# Altium schematic sheet Sheet1.SchDoc
size A3
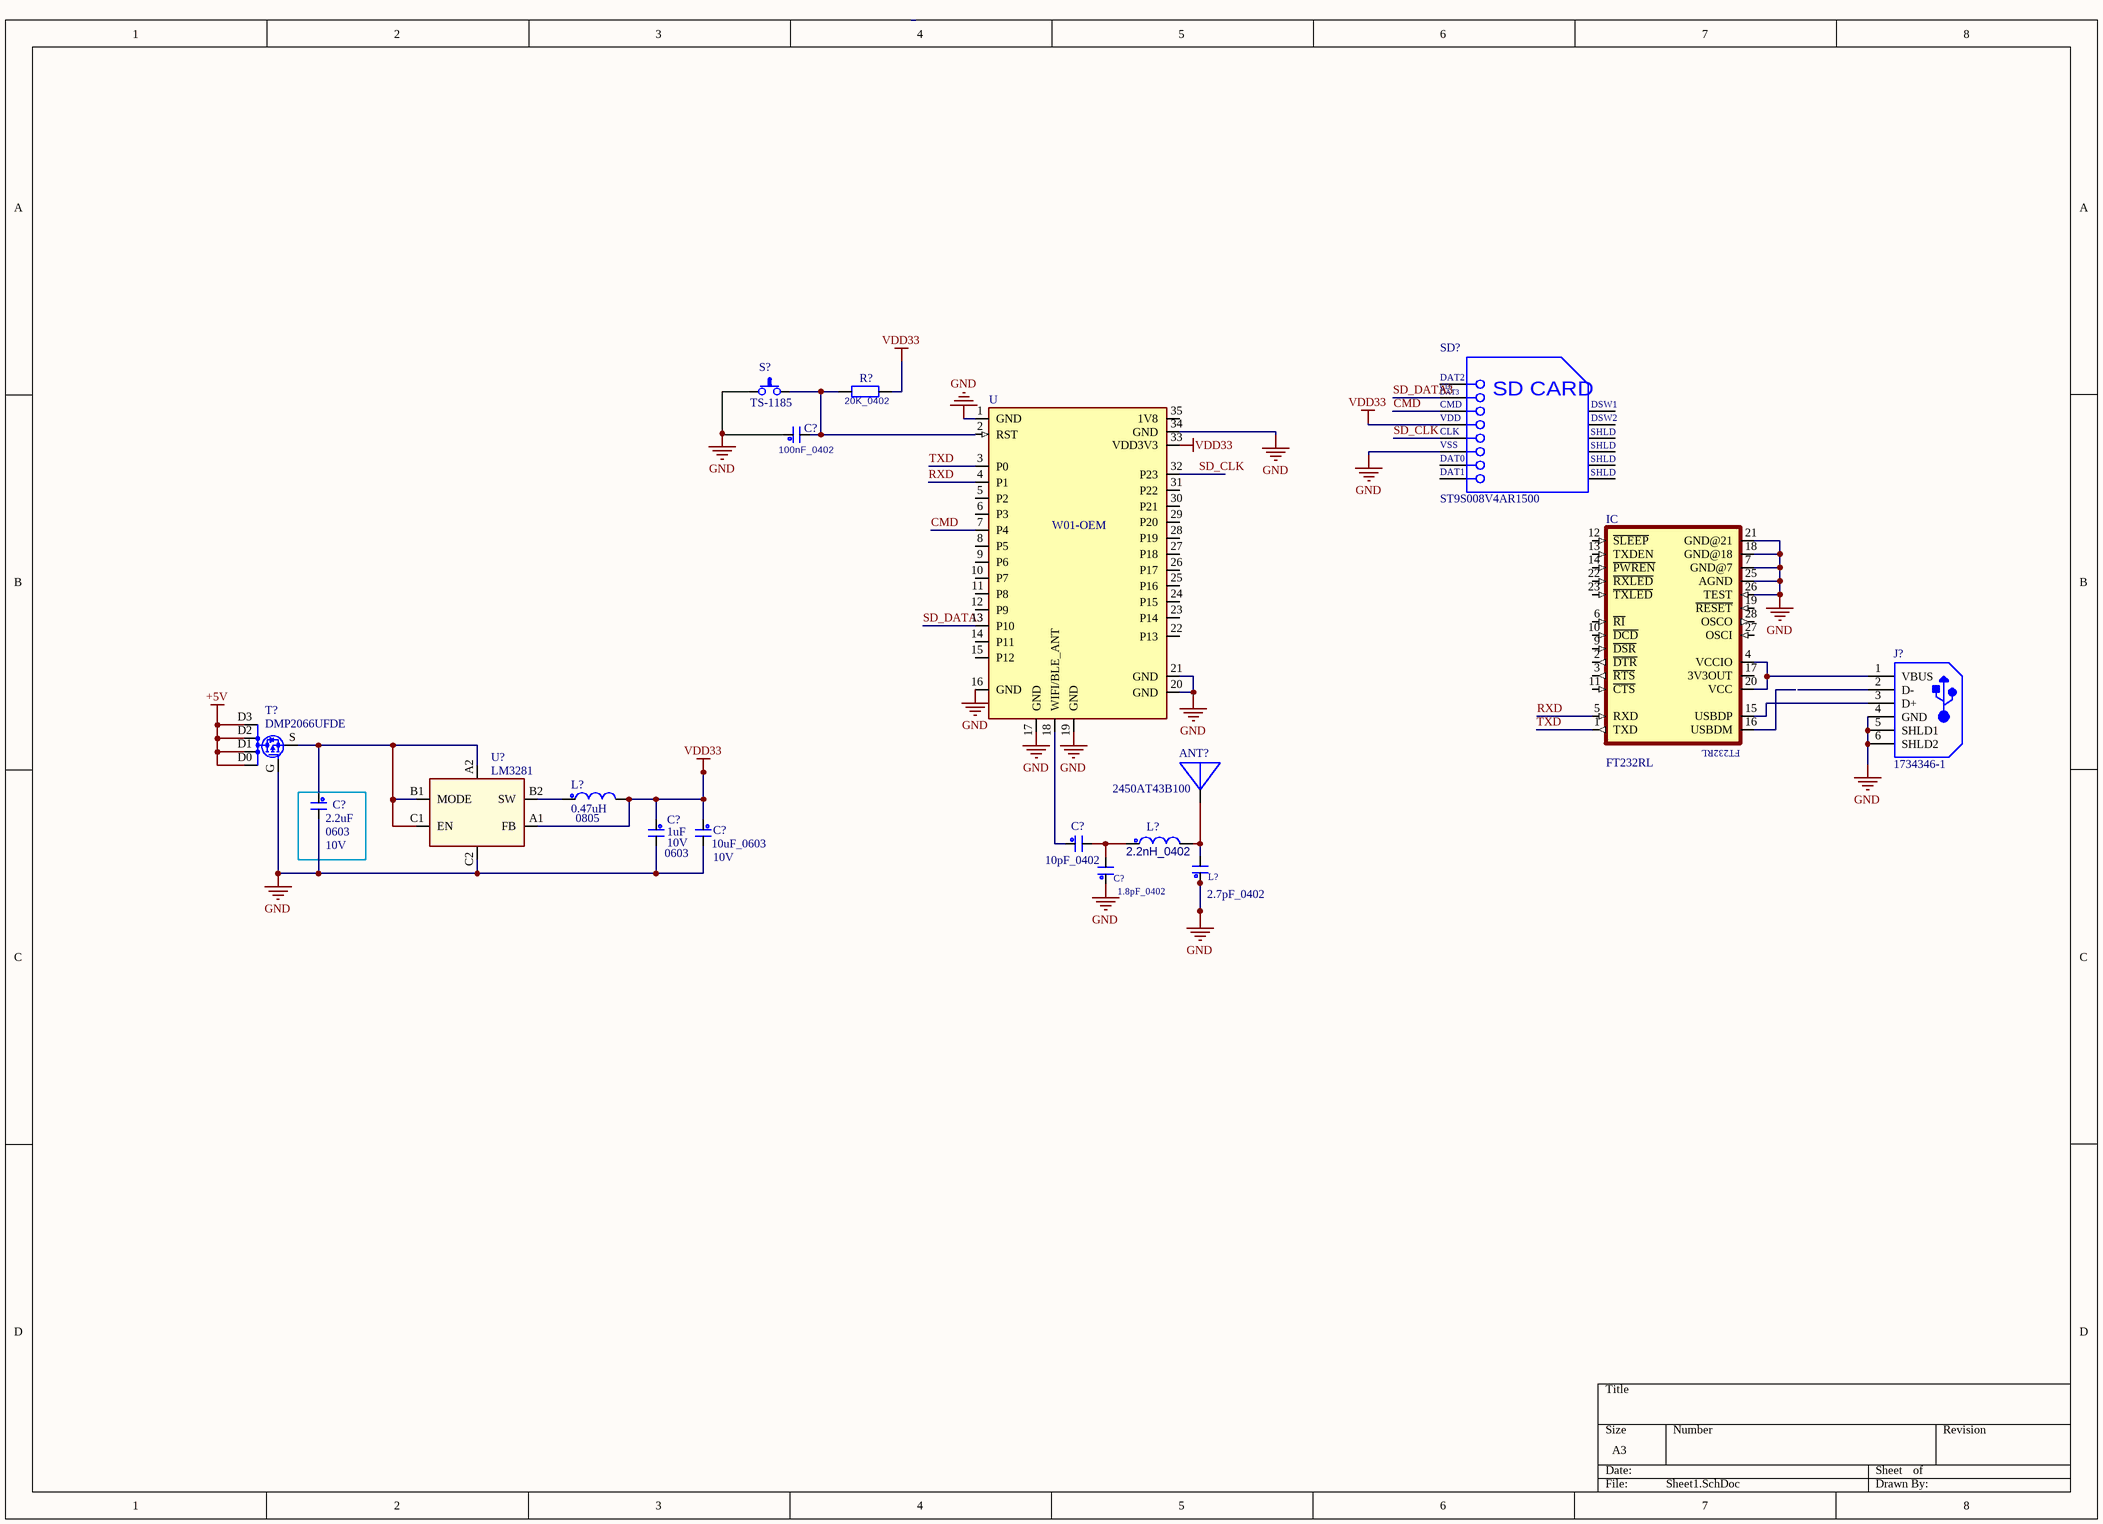
[diagram p0: Sheet1.SchDoc]

## Parts
(Parts that share a designator on the sheet are numbered #1, #2 ... from top to bottom, then left to right.)
ANT?  value 2450AT43B100  [ANT-2450AT43B100]  (hidden comment: ANT2450AT43B100)
C?#1  100nF_0402  [0402C]
C?#2  value 2.2uF  Voltage Rating: 10V  FOOTPRINT: 0603  [0603C]  (hidden comment: 2.2UF_0603)
C?#3  value 1uF  Voltage Rating: 10V  footprint: 0603  [0603C]  (hidden comment: 1uF_0603)
C?#4  10uF_0603  Voltage Rating: 10V  [0603C]
C?#5  10pF_0402  [0402CS]
C?#6  1.8pF_0402  [0402CS]
IC  FT232RL  [SSOP28-LD]
J?  1734346-1  [TECO-1734346-1_V]
L?#1  value 0.47uH  PCB DECAL: 0805  [0805L]  (hidden comment: 0.47uH_0805)
L?#2  2.2nH_0402  [0402CS]
L?#3  2.7pF_0402  [0402CS]
R?  20K_0402  [0402R]
S?  TS-1185  [SW-TS-1185]
SD?  ST9S008V4AR1500  [JAE-ST9S008V4AR1500_V]
T?  DMP2066UFDE  [U-DFN2020-6]
U  W01-OEM  [PYCOM_W01-OEM]
U?  value LM3281  [DSBGA6(YFQ)]  (hidden comment: IC-LM3281)

## Nets
+5V: T?.D0 T?.D1 T?.D2 T?.D3
GND: C?#1.1 C?#2.2 C?#3.2 C?#4.2 C?#6.1 IC.7(GND@7) IC.18(GND@18) IC.21(GND@21) IC.25(AGND) IC.26(TEST) J?.4(GND) J?.5(SHLD1) J?.6(SHLD2) L?#3.1 S?.1 SD?.6(VSS) T?.G U.1(GND) U.16(GND) U.17(GND) U.19(GND) U.20(GND) U.21(GND) U.34(GND) U?.C2(Gnd)
VDD33: C?#3.1 C?#4.1 L?#1.2 R?.2 SD?.4(VDD) U.33(VDD3V3) U?.A1(FB)
CMD: SD?.3(CMD) U.7(P4)
RXD: IC.5(RXD) U.4(P1)
SD_CLK: SD?.5(CLK) U.32(P23)
SD_DATA3: SD?.2(CD/DAT3) U.13(P10)
TXD: IC.1(TXD) U.3(P0)
NetANT?_1: ANT?.1 L?#2.2 L?#3.2
NetC?#1_2: C?#1.2 R?.1 S?.2 U.2(RST)
NetC?#2_1: C?#2.1 T?.S U?.A2 U?.B1(MODE) U?.C1(EN)
NetC?#5_1: C?#5.1 U.18(WIFI/BLE_ANT)
NetC?#5_2: C?#5.2 C?#6.2 L?#2.1
NetIC_4: IC.4(VCCIO) IC.20(VCC) J?.1(VBUS)
NetL?#1_1: L?#1.1 U?.B2(SW)

Not connected (* = marked no-connect by the designer): IC 2(~{DTR}) 3(~{RTS}) 6(~{RI}) 9(~{DSR}) 10(~{DCD}) 11(~{CTS}) 12(~{SLEEP}) 13(TXDEN) 14(~{PWREN}) 15(USBDP) 16(USBDM) 17(3V3OUT) 19(~{RESET}) 22(~{RXLED}) 23(~{TXLED}) 27(OSCI) 28(OSCO); J? 2(D-) 3(D+); SD? 1(DAT2) 7(DAT0) 8(DAT1) 9(DSW1) 10(DSW2) 11(SHLD) 12(SHLD) 13(SHLD) 14(SHLD); U 5(P2) 6(P3) 8(P5) 9(P6) 10(P7) 11(P8) 12(P9) 14(P11) 15(P12) 22(P13) 23(P14) 24(P15) 25(P16) 26(P17) 27(P18) 28(P19) 29(P20) 30(P21) 31(P22) 35(1V8)

## Notes on the sheet
- (in symbol CMP-1754-00001-2) CD/; DAT3; SD CARD

## Library data of the parts
ANT? = ANT2450AT43B100: Part Number: EAT-6548454-00
C?#1 = CC0402/100NF/K%16V: Part Number: ECH-012K104-39; Tolerance: +/-10 %; Voltage Rating: 16V; Value: 100nF_0402
C?#2 C?#4 = CC0603/10UF/10V/K%: Part Number: ECH-181K106-04; Tolerance: +/-10 %
  C?#4: Value: 10uF_0603
C?#3 = CC0603/1UF/K%/10V: Part Number: ECH-112K105-21; Tolerance: +/-10 %
C?#5 = CC0402/10PF/D%_S: Part Number: ECH-004D100-21; Tolerance: +/-0.5pF; Voltage Rating: 50V; PCB DECAL: 0402; Value: 10pF_0402
C?#6 L?#3 = CC0402/0,5pF/+/-0.1pF_S: Part Number: ECH-004B059-37; PCB DECAL: 0402; Vender: Murata  GJM1555C1HR50BB01J D C0G/NP0; Tolerance: +/-0.1pF
  C?#6: Value: 1.8pF_0402
  L?#3: Value: 2.7pF_0402
IC = FT232RL: USB ë¸Œë¦¬ì§€, USB-UART USB 2.0 UART ì¸í„°íŽ˜ì´ìŠ¤ 28-SSOP; MF: FTDI, Future; Package: SSOP-28 FTDI, Future; Price: None; Availability: Unavailable; MP: FT232RL; SnapEDA_Link: https://www.snapeda.com/parts/FT232RL/FTDI%2C%20Future%20Technology%20Devices%20International%20Ltd/view-part/1077088/?ref=snap; Value: *
J? = CMP-2000-07498-1: USB-B Receptacle Connector, Height 10.87 mm, 0 to 50 degC, RoHS, Tray; Manufacturer: TE Connectivity; Insulation Resistance: 1GR; Number of Contacts: 4; Number of Ports: 1; Plating: Nickel; Case\/Package: SMD/SMT; Insulation Material: Thermoplastic; Gender: Receptacle; Depth: 16mm; Contact Material: Bronze; Length: 16.5mm; ELV: Compliant; Packaging: Tray; RoHSCompliant: true; Number of Terminals: 4; Manufacturer URL: http://www.te.com/; Datasheet Version: Rev. C, 06/2011; Package Reference: 1734346-1; Flammability Rating: UL94V-0; Package Description: 4-Pin Pin Surface Mount Device, Body 12.04 x 16 mm, Height 10.87 mm; Mount: Horizontal; Mounting Technology: SurfaceMount; REACH SVHC: Unknown; Material: Bronze; Housing Colour: Black; Contact Plating: Gold; Package Quantity: 100; Orientation: RightAngle; Termination: SMD/SMT; Housing Material: Nylon; Number of Positions: 4; Datasheet URL: http://www.te.com/commerce/DocumentDelivery/DDEController?Action=srchrtrv&DocNm=1734346&DocType=Customer+Drawing&DocLang=English; Connector Type: Receptacle
L?#1 = IND0805/0.47uH/20%: Part Number: ELC-4Z0M474-11; Tolerance: +/-20%
L?#2 = IND0402/6.8nH/+/-0.1nH_S: Part Number: ELC-141B6N8-11; Tolerance: ±0.1nH; Vendor: Murata LQP15MN6N8B02D RF quality; Value: 2.2nH_0402
R? = RC0402/100K/F%: Part Number: ERH-10F4104-01; PCB DECAL: 0402; Tolerance: 1%; Value: 20K_0402
S? = SW-TS-1185: Part Number: EKS-5M10685-11; VALUE2: PRG; VALUE1: TS-1185
SD? = CMP-1754-00001-2: Micro SD Memory Card Connector, -25 to 85 degC, 8-Pin SMD, RoHS, Tape and Reel; RevisionId: 1; Folder: Unified Components\Components\JAE Electronics\No Category\; ContentType: Unified Component; Shielding: Unshielded; Tolerance: 5%; AccessRights: 2147483647; Current Rating: 400 mA; Case\Package: 0402; Packaging: Tape and Reel; ItemHRID: CMP-1754-00001; ItemGUID: D595BEF2-BEDF-4B93-B441-FF9E92F57A35; Radiation Hardening: No; DatasheetVersion: Dec-08; Height: 0.5 mm; PackageReference: ST9S008V4AR1500; Case Code (Imperial): 0402; PackageVersion: Rev. 2, 12/2007; Length: 1 mm; Package Quantity: 10000; Case Code (Metric): 1005; Weight: 2.8E-05 oz; Mount: Surface Mount; ReleaseDate: 28/09/2016 03:22:52 AM; Min Operating Temperature: -20 degC; ComponentLink2Description: Datasheet; ComponentLink3URL: https://datasheet.ciiva.com/683/sj108062-683405.pdf; FolderGUID: 1D9C01E6-A246-4853-A9B2-975107405A4E; Max Operating Temperature: 85 degC; ComponentLink1URL: http://www.jaeusa.com/; LifeCycleStateGUID: 61E382EE-6656-4F12-9E24-BE9327104A25; ComponentLink3Description: Package Specification; ContentTypeGUID: CB3C11C4-E317-11DF-B822-12313F0024A2; ComponentLink1Description: Manufacturer URL; LifeCycle: Released; ComponentLink2URL: http://jae-connector.com/en/pdf/MB-0177-1E_ST9.pdf; RoHSCompliant: true; Width: 0.5 mm; PackageDescription: 8-Pin Surface Mount Device, Body 15.2 x 13.7 mm, Pitch 1.1 mm
T? = FET-P-DMP2066UFDE: Part number: EST-3451A6T-11; Value: DMP2066UFDE
U = W01-OEM: The W01 is the WiPy OEM module. It works exactly like your WiPy but weâ€™ve trimmed a few bits to make it smaller and easier to integrate. Dual network BLE and WiFi.; MF: Pycom; Value: *; Availability: Unavailable; Price: None; SnapEDA_Link: https://www.snapeda.com/parts/W01-OEM/Pycom/view-part/1039089/?ref=snap; Package: None; MP: W01-OEM
U? = IC-LM3281: Part Number: ESC-1186AVV-00; PCB DECAL: SOT-23-5